# EAGLE design FeatherWing_for_Grove (EAGLE 7.6.0)
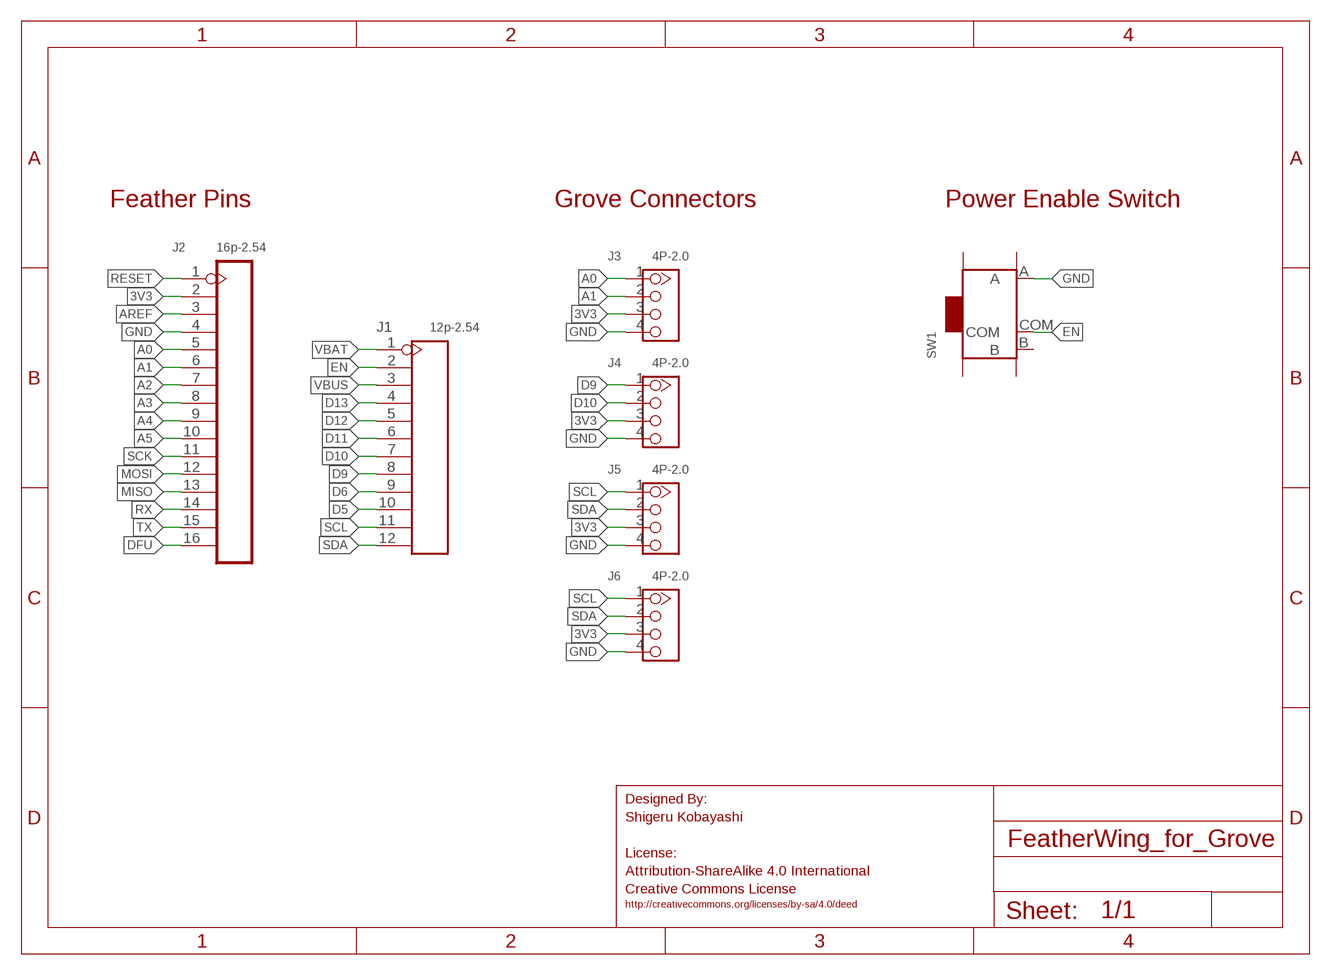
[diagram p0: schematic, sheet 1]

## Parts
J1  12p-2.54  DIP-BLACK-MALE-HEADER(12P-2.54)  [H12-2.54]
J2  16p-2.54  DIP-BLACK-MALE-HEADER-VERT(16P-2.54)  [H16-2.54]
J3  4P-2.0  GROVE-CONNECTOR-DIP(4P-2.0)  [HW4-2.0]
J4  4P-2.0  GROVE-CONNECTOR-DIP(4P-2.0)  [HW4-2.0]
J5  4P-2.0  GROVE-CONNECTOR-DIP(4P-2.0)  [HW4-2.0]
J6  4P-2.0  GROVE-CONNECTOR-DIP(4P-2.0)  [HW4-2.0]
SW1  SMD-TOGGLE-SWITCH-ON-ON(3+4P-6.7X2.7MM)  [SW7-SMD-L6.7X2.7X3.2MM]

## Nets
3V3: J2.2 J3.3 J4.3 J5.3 J6.3
A0: J2.5 J3.1
A1: J2.6 J3.2
A2: J2.7
A3: J2.8
A4: J2.9
A5: J2.10
AREF: J2.3
D5: J1.10
D6: J1.9
D9: J1.8 J4.1
D10: J1.7 J4.2
D11: J1.6
D12: J1.5
D13: J1.4
DFU: J2.16
EN: J1.2 SW1.COM
GND: J2.4 J3.4 J4.4 J5.4 J6.4 SW1.A
MISO: J2.13
MOSI: J2.12
RESET: J2.1
RX: J2.14
SCK: J2.11
SCL: J1.11 J5.1 J6.1
SDA: J1.12 J5.2 J6.2
TX: J2.15
VBAT: J1.1
VBUS: J1.3
Unconnected: SW1.B SW1.SS1 SW1.SS2 SW1.SS3 SW1.SS4

## Notes on the sheet
- Feather Pins | Grove Connectors | Power Enable Switch
- Designed By: 
  Shigeru Kobayashi
  
  License: 
  Attribution-ShareAlike 4.0 International
  Creative Commons License
- http://creativecommons.org/licenses/by-sa/4.0/deed

## Library data of the parts
J1 = Seeed-OPL-Connector:DIP-BLACK-MALE-HEADER(12P-2.54): 320020112; MPN: P125-1112A0BS116AX
J2 = Seeed-OPL-Connector:DIP-BLACK-MALE-HEADER-VERT(16P-2.54): 320020034; MPN: P125-1116A0BS116AX
J3-J6 = Seeed-OPL-Connector:GROVE-CONNECTOR-DIP(4P-2.0): 320110033
SW1 = Seeed-OPL-Switch:SMD-TOGGLE-SWITCH-ON-ON(3+4P-6.7X2.7MM): 311030001

## Board
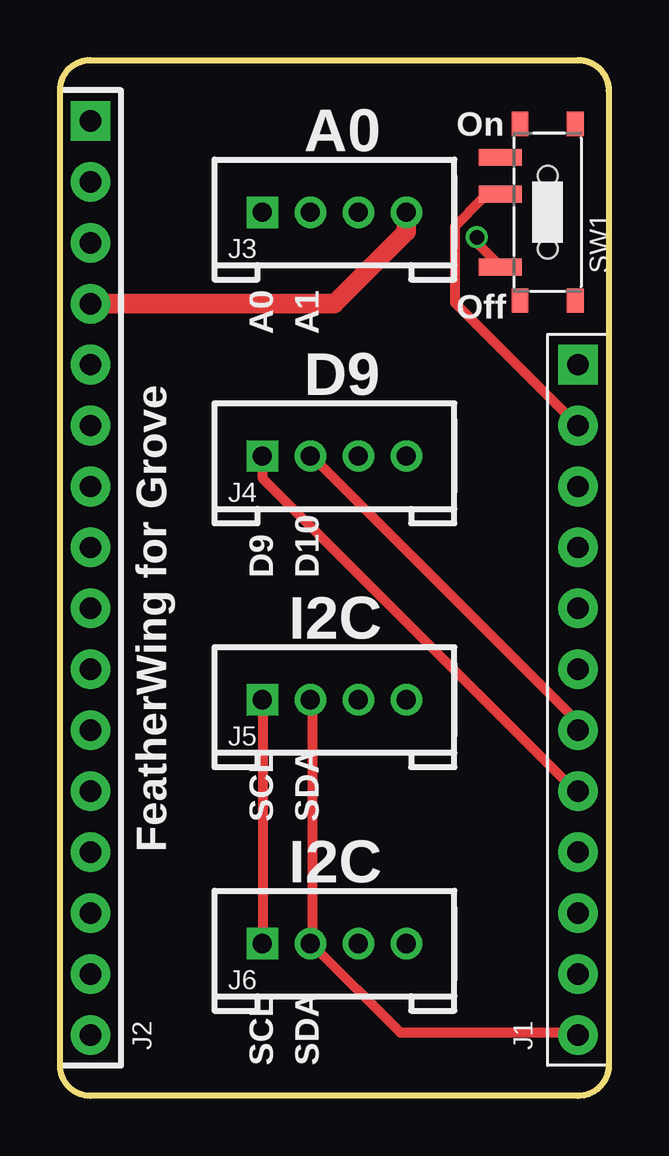
[diagram p1: board, top side]
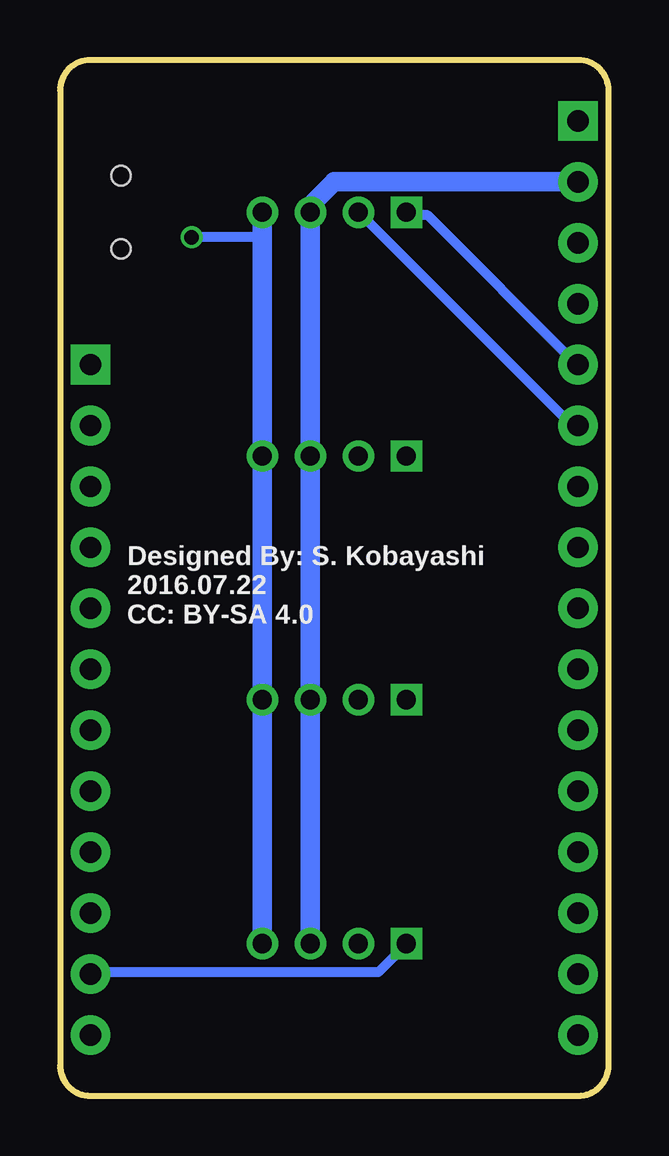
[diagram p2: board, bottom side, seen from below]

Size 22.86 x 43.18 mm. Coordinates in mm from the lower left corner, seen from the top.
Outline: 0,41.91 arc-90 1.27,43.18 21.59,43.18 arc-90 22.86,41.91 22.86,1.27 arc-90 21.59,0 1.27,0 arc-90 0,1.27 0,41.91
Copper layers (1*16): Top 0.035mm / dielectric 1.5mm / Bottom 0.035mm
Design rules "ssci_SeeedStudio_2layer_DRU_no_angle": minimum track width 6mil, minimum drill 12mil, track to track 6mil, track to pad 6mil, pad to pad 6mil, via to via 6mil, smd to smd 0mil, copper to edge 10mil, drill to drill 10mil, minimum pad ring 10mil, minimum via ring 6mil, stop-mask expansion 2mil, vias tented up to drill 25mil, thermal gap 10mil

### Footprints (pad centres in the part's own frame; a part is rotated, then mirrored left to right if it is on the bottom)
H12-2.54 = drill 0.889 pad 1.651 square: 1 0,13.97 | drill 0.889 pad 1.651: 2 0,11.43; 3 0,8.89; 4 0,6.35; 5 0,3.81; 6 0,1.27; 7 0,-1.27; 8 0,-3.81; 9 0,-6.35; 10 0,-8.89; 11 0,-11.43; 12 0,-13.97
H16-2.54 = drill 0.889 pad 1.651 square: 1 0,-19.05 | drill 0.889 pad 1.651: 2 0,-16.51; 3 0,-13.97; 4 0,-11.43; 5 0,-8.89; 6 0,-6.35; 7 0,-3.81; 8 0,-1.27; 9 0,1.27; 10 0,3.81; 11 0,6.35; 12 0,8.89; 13 0,11.43; 14 0,13.97; 15 0,16.51; 16 0,19.05
HW4-2.0 = drill 0.8 pad 1.27 square: 1 -3,0 | drill 0.8 pad 1.27: 2 -1,0; 3 1,0; 4 3,0
SW7-SMD-L6.7X2.7X3.2MM = smd 1.8 x 0.7: A 1.978,2.286; B 1.978,-2.286; COM 1.978,-0.762 | smd 0.7 x 1.016: SS1 -1.15,-3.683; SS2 1.15,-3.683; SS3 1.15,3.683; SS4 -1.15,3.683 | hole 0.813: 0,-1.524; 0,1.524

### Placement (x,y rotation side)
J1  21.59,16.51 0 top
J2  1.27,21.59 180 top
J3  11.43,36.83 0 top
J4  11.43,26.67 0 top
J5  11.43,16.51 0 top
J6  11.43,6.35 0 top
SW1  20.32,36.83 180 top

### Tracks (layer width: path | path; a pad name or v marks a point on that pad's centre or on a via)
3V3
  Bottom 0.254: J5.3 12.57,16.59 12.43,16.59 | 12.43,26.64 12.57,26.64 J4.3
  Bottom 0.813: J6.3 J5.3 12.43,16.59 12.43,26.64 J4.3 J3.3 12.43,37.1 11.43,38.1 J2.2
A0
  Bottom 0.406: J3.1 8.23,36.7 7.54,36.7 1.37,30.53 J2.5
A1
  Bottom 0.406: J3.2 10.29,36.7 1.37,27.79 J2.6
D9
  Top 0.254: 8.46,26.64 J4.1
  Top 0.406: 8.46,26.64 8.46,25.73 21.49,12.7 J1.8
D10
  Top 0.305: 10.52,26.64 J4.2
  Top 0.406: 10.52,26.64 21.72,15.44 J1.7
EN
  Top 0.254: 17.6,37.39 18.29,37.39 SW1.COM | 21.49,28.02 J1.2
  Top 0.406: 17.6,37.39 16.46,36.25 16.46,33.05 21.49,28.02
GND  (via drill 0.61)
  Top 0.254: 18.29,34.65 SW1.A
  Top 0.406: 18.29,34.65 17.37,35.56 v17.37,35.79
  Top 0.813: J2.4 11.43,33.02 14.43,36.02 J3.4
  Bottom 0.254: J5.4 14.4,16.59 14.43,16.59 | J4.4 14.4,26.87 14.43,26.87
  Bottom 0.406: 14.43,35.79 v17.37,35.79
  Bottom 0.813: J3.4 14.43,35.79 14.43,26.87 J4.4 14.43,16.59 J5.4 J6.4
SCL
  Top 0.305: 8.46,6.53 J6.1
  Top 0.406: 8.46,6.53 8.46,16.36 J5.1
  Bottom 0.254: 8.46,6.3 J6.1
  Bottom 0.406: 8.46,6.3 9.6,5.16 21.49,5.16 J1.11
SDA
  Top 0.254: 10.52,6.3 J6.2
  Top 0.305: 21.49,2.64 J1.12
  Top 0.406: J6.2 10.52,6.53 10.52,16.36 J5.2 | 21.49,2.64 14.17,2.64 10.52,6.3

### Text on the board
tNames: On | A0 | Off | A0 | A1 | D9 | D9 | D10 | I2C | SCL | SDA | FeatherWing for Grove | I2C | SCL | SDA
bNames: Designed By: S. Kobayashi / 2016.07.22 / CC: BY-SA 4.0